# EAGLE design phono (EAGLE 5.11)
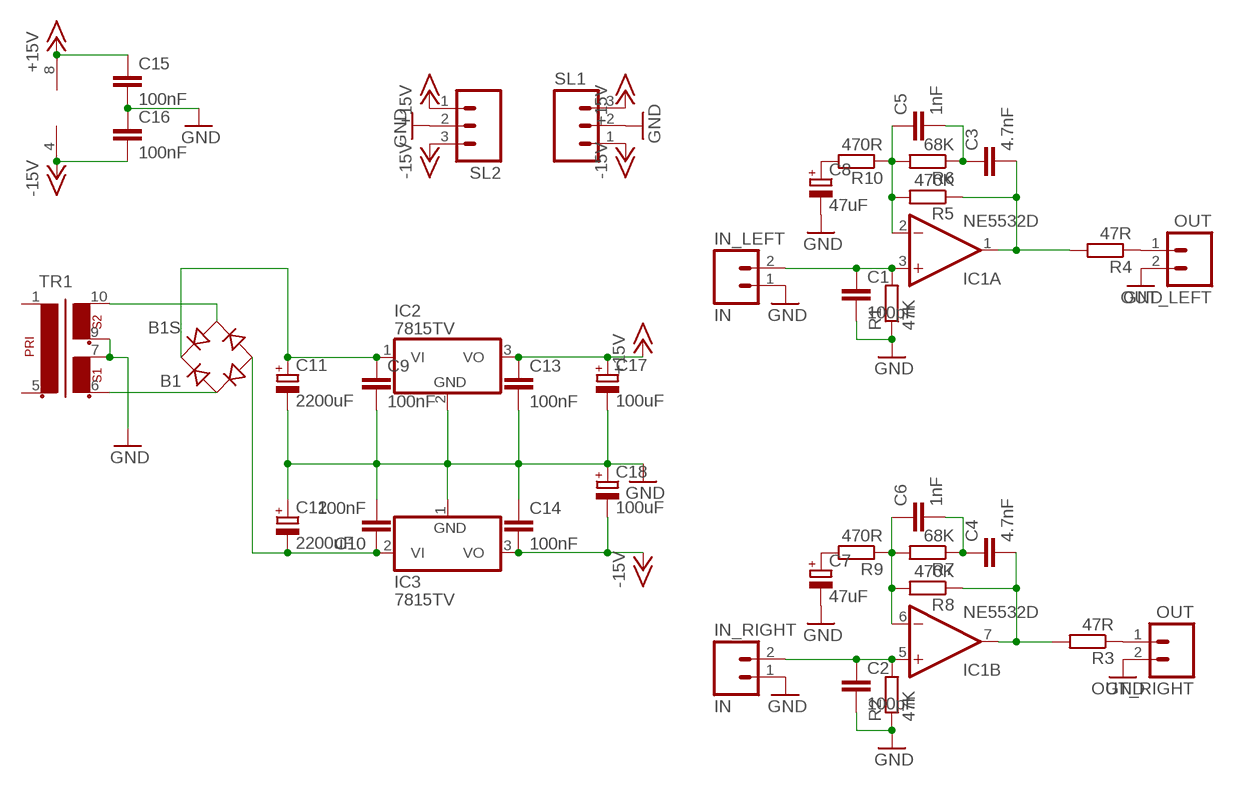
[diagram p0: schematic, sheet 1]

## Parts
B1  B1S  [MBS]
C1  100pF  C-EUC0805K  [C0805K]
C2  100pF  C-EUC0805K  [C0805K]
C3  4.7nF  C-EUC0805K  [C0805K]
C4  4.7nF  C-EUC0805K  [C0805K]
C5  1nF  C-EUC0805K  [C0805K]
C6  1nF  C-EUC0805K  [C0805K]
C7  47uF  CPOL-EUE5-5  [E5-5]
C8  47uF  CPOL-EUE5-5  [E5-5]
C9  100nF  C-EUC0805K  [C0805K]
C10  100nF  C-EUC0805K  [C0805K]
C11  2200uF  CPOL-EUE5-13  [E5-13]
C12  2200uF  CPOL-EUE5-13  [E5-13]
C13  100nF  C-EUC0805K  [C0805K]
C14  100nF  C-EUC0805K  [C0805K]
C15  100nF  C-EUC0805K  [C0805K]
C16  100nF  C-EUC0805K  [C0805K]
C17  100uF  CPOL-EUE5-13  [E5-13]
C18  100uF  CPOL-EUE5-13  [E5-13]
IC1  NE5532D  [SO08]
IC2  7815TV  [TO220V]
IC3  7815TV  7915V  [TO220V]
IN_LEFT  IN  M02  [02P]
IN_RIGHT  IN  M02  [02P]
OUT_LEFT  OUT  M02  [02P]
OUT_RIGHT  OUT  M02  [02P]
R1  47K  R-EU_R0805W  [R0805W]
R2  47K  R-EU_R0805W  [R0805W]
R3  47R  R-EU_R0805W  [R0805W]
R4  47R  R-EU_R0805W  [R0805W]
R5  470K  R-EU_R0805W  [R0805W]
R6  68K  R-EU_R0805W  [R0805W]
R7  68K  R-EU_R0805W  [R0805W]
R8  470K  R-EU_R0805W  [R0805W]
R9  470R  R-EU_R0805W  [R0805W]
R10  470R  R-EU_R0805W  [R0805W]
SL1  M03  [03P]
SL2  M03  [03P]
TR1  EI30-2  [EI30-2]

## Nets
+15V: C13.1 C15.1 C17.+ IC1.8(P:V+) IC2.3(VO) SL1.3 SL2.1
-15V: C14.2 C16.2 C18.- IC1.4(P:V-) IC3.3(VO) SL1.1 SL2.3
GND: C1.2 C2.2 C7.- C8.- C9.2 C10.2 C11.- C12.+ C13.2 C14.1 C15.2 C16.1 C17.- C18.+ IC2.2(GND) IC3.1(GND) IN_LEFT.1 IN_RIGHT.1 OUT_LEFT.2 OUT_RIGHT.2 R1.1 R2.1 SL1.2 SL2.2 TR1.7 TR1.9
N$1: B1.AC2 TR1.10
N$2: C3.2 IC1.1(A:OUT) R4.2 R5.1
N$3: C3.1 C5.2 R6.1
N$4: C4.1 C6.2 R7.1
N$5: C1.1 IC1.3(A:+IN) IN_LEFT.2 R1.2
N$6: C5.1 IC1.2(A:-IN) R5.2 R6.2 R10.1
N$7: B1.AC1 TR1.6
N$9: C2.1 IC1.5(B:+IN) IN_RIGHT.2 R2.2
N$10: C6.1 IC1.6(B:-IN) R7.2 R8.2 R9.1
N$11: C4.2 IC1.7(B:OUT) R3.2 R8.1
N$12: B1.+ C9.1 C11.+ IC2.1(VI)
N$13: C7.+ R9.2
N$14: C8.+ R10.2
N$15: B1.- C10.1 C12.- IC3.2(VI)
N$18: OUT_LEFT.1 R4.1
N$19: OUT_RIGHT.1 R3.1
Unconnected: TR1.1 TR1.5

## Library data of the parts
B1 = rectifier:B*S: Surface Mount Glass Passivated Bridge Rectifiers Source: Comchip Bridge Rectifiers B05S-G_B10S-G.pdf
C1-C6 C9 C10 C13-C16 = resistor:C-EU: CAPACITOR, European symbol
C7 C8 C11 C12 C17 C18 = resistor:CPOL-EU: POLARIZED CAPACITOR, European symbol
IC1 = linear:NE5532: AUDIO AMPLIFIER
IC2 = linear:78*: Positive VOLTAGE REGULATOR Source: http://cache.national.com/ds/LM/LM78L05.pdf http://www.fairchildsemi.com/ds/LM/LM7805.pdf
IC3 = linear:79*: Negative VOLTAGE REGULATOR
IN_LEFT IN_RIGHT OUT_LEFT OUT_RIGHT = con-amp-quick:M02: AMP QUICK CONNECTOR; OC_FARNELL: unknown; OC_NEWARK: unknown
R1-R10 = resistor:R-EU_: RESISTOR, European symbol
SL1 SL2 = con-amp-quick:M03: AMP QUICK CONNECTOR; OC_FARNELL: unknown; OC_NEWARK: unknown
TR1 = trafo:EI30-2: TRANSFORMER 1 primary winding, 2 secondary windings ERA

## Board
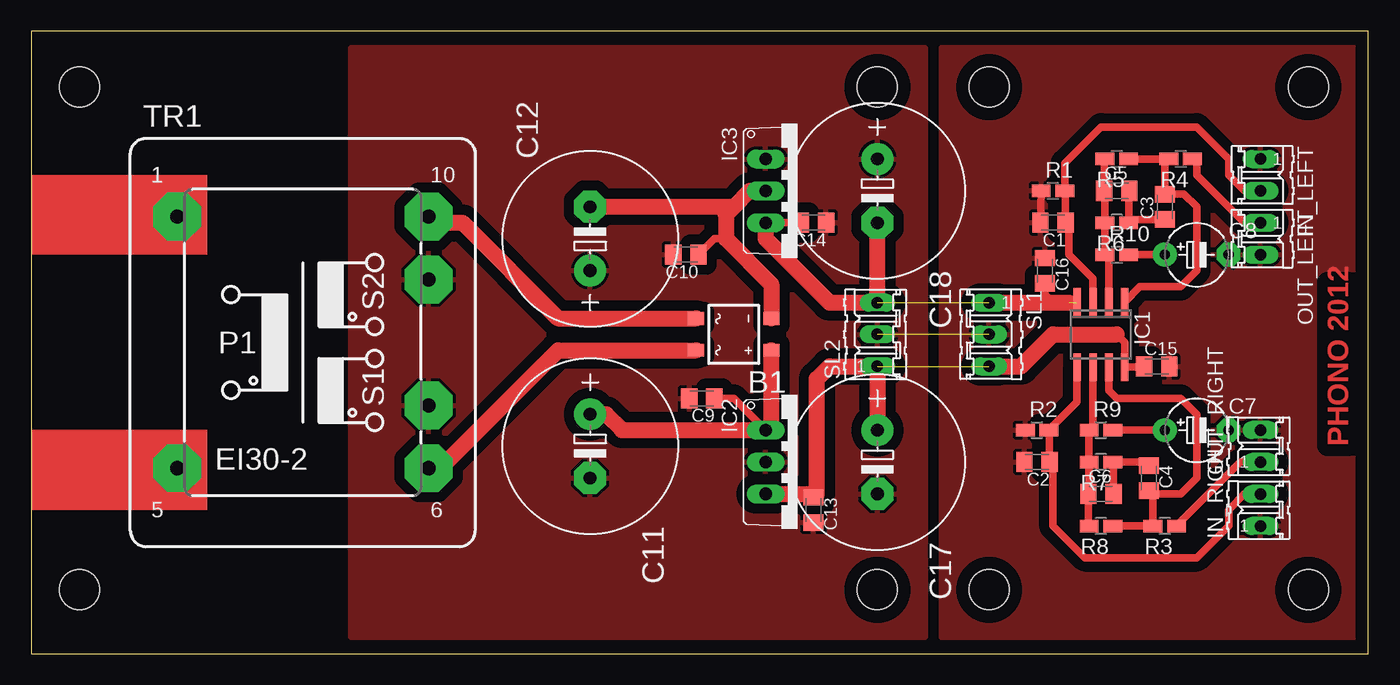
[diagram p1: board, top side]

Size 106.35 x 49.52 mm. Coordinates in mm from the lower left corner, seen from the top.
Outline: 0,0 106.35,0 106.35,49.52 0,49.52 0,0
Copper layers (1*16): Top 0.035mm / dielectric 1.5mm / Bottom 0.035mm
Design rules "default": minimum track width 10mil, minimum drill 24mil, track to track 8mil, track to pad 8mil, pad to pad 8mil, via to via 8mil, smd to smd 8mil, copper to edge 40mil, drill to drill 8mil, minimum pad ring 10mil, minimum via ring 8mil, stop-mask expansion 4mil, vias tented up to drill 0mil, thermal gap 10mil
Holes 3.2 mm at 3.81,45.09 101.6,45.09 101.6,5.08 3.81,5.08 76.2,45.09 76.2,5.08 67.31,5.08 67.31,45.09

### Footprints (pad centres in the part's own frame; a part is rotated, then mirrored left to right if it is on the bottom)
MBS = smd 1 x 1.3: + -1.27,-3; - 1.27,-3; AC1 -1.27,3; AC2 1.27,3
C0805K = smd 1.3 x 1.6: 1 -1,0; 2 1,0
E5-5 = drill 0.813 pad 1.905 round: + -2.54,0 | drill 0.813 pad 1.905 octagon: - 2.54,0
E5-13 = drill 1.016 pad 2.54 round: + -2.54,0 | drill 1.016 pad 2.54 octagon: - 2.54,0
SO08 = smd 0.6 x 2.2: 1 -1.905,-2.6; 2 -0.635,-2.6; 3 0.635,-2.6; 4 1.905,-2.6; 5 1.905,2.6; 6 0.635,2.6; 7 -0.635,2.6; 8 -1.905,2.6
TO220V = drill 1.016 long: 1 -2.54,-2.54; 2 0,-2.54; 3 2.54,-2.54
02P = drill 0.914 long: 1 -1.27,0; 2 1.27,0
R0805W = smd 1.5 x 1: 1 -0.94,0; 2 0.94,0
03P = drill 0.914 long: 1 -2.54,0; 2 0,0; 3 2.54,0
EI30-2 = drill 1.118 pad 3.81 octagon: 1 -10.008,10.008; 5 -10.008,-10.008; 6 10.008,-10.008; 7 10.008,-5.004; 9 10.008,5.004; 10 10.008,10.008

### Placement (x,y rotation side)
B1  55.88,25.4 90 top
C1  81.28,34.29 180 top
C2  80.01,15.24 180 top
C3  90.17,35.56 90 top
C4  88.9,13.97 270 top
C5  86.36,36.83 0 top
C6  85.09,12.7 0 top
C7  92.71,17.78 0 top
C8  92.71,31.75 0 top
C9  53.34,20.32 180 top
C10  52.07,31.75 180 top
C11  44.45,16.51 270 top
C12  44.45,33.02 90 top
C13  62.23,11.43 270 top
C14  62.23,34.29 180 top
C15  89.53,22.86 0 top
C16  80.64,30.48 270 top
C17  67.31,15.24 270 top
C18  67.31,36.83 270 top
IC1  85.09,25.4 180 top
IC2  60.96,15.24 270 top
IC3  60.96,36.83 270 top
IN_LEFT  97.79,38.1 270 top
IN_RIGHT  97.79,11.43 90 top
OUT_LEFT  97.79,33.02 270 top
OUT_RIGHT  97.79,16.51 90 top
R1  81.28,36.83 0 top
R2  80.01,17.78 0 top
R3  90.17,10.16 180 top
R4  91.44,39.37 180 top
R5  86.36,39.37 180 top
R6  86.36,34.29 180 top
R7  85.09,15.24 180 top
R8  85.09,10.16 180 top
R9  85.09,17.78 0 top
R10  86.36,31.75 0 top
SL1  76.2,25.4 270 top
SL2  67.31,25.4 90 top
TR1  21.59,24.77 0 top

### Tracks (layer width: path | path; a pad name or v marks a point on that pad's centre or on a via)
+15V  (1 unrouted)
  Top 0.61: 86.36,25.4 87,24.77 IC1.8 88.47,22.8 C15.1
  Top 1.27: IC2.3 61.96,12.7 C13.1 62.5,12.7 62.5,21.86 63.5,22.86 SL2.1 C17.+ | SL1.3 78.74,22.86 81.28,25.4 86.36,25.4
-15V  (2 unrouted)
  Top 0.61: IC1.4 83.12,27.94 | C16.2 80.64,28.57 81.28,27.94 | IC3.3 C14.2
  Top 1.27: 82.55,27.94 81.28,27.94 SL1.1 | C18.- SL2.3 63.5,27.94 58.42,33.02 IC3.3
GND  (1 unrouted)
  Top 0.61: C1.2 80.28,34.23 R1.1
  pour Top (isolate 0.813): 72.39,48.26 105.41,48.26 105.41,1.27 72.39,1.27
  pour Top (isolate 0.813): 25.4,48.26 71.12,48.26 71.12,1.27 25.4,1.27
N$1
  Top 1.27: B1.AC2 41.91,26.67 34.29,34.29 32.08,34.29 TR1.10
N$2
  Top 0.61: IC1.1 88.2,29.21 91.44,29.21 92.71,30.48 92.71,35.56 91.71,36.56 C3.2 90.17,39.04 R4.2 R5.1
N$3
  Top 0.61: C5.2 87.3,36.77 R6.1 87.57,34.56 C3.1
N$4
  Top 0.61: C6.2 86.09,15.18 R7.1 88.63,15.24 C4.1
N$5
  Top 0.61: IC1.3 84.45,29.84 82.55,31.75 82.55,34.02 C1.1 82.28,36.77 R1.2 82.22,39.04 85.09,41.91 92.71,41.91 95.25,39.37 95.25,38.1 96.52,36.83 IN_LEFT.2
N$6
  Top 0.61: IC1.2 85.72,31.45 R10.1 R6.2 85.42,36.77 C5.1 85.36,39.31 R5.2
N$7
  Top 1.27: B1.AC1 41.91,24.13 33.02,15.24 32.08,15.24 TR1.6
N$9
  Top 0.61: IC1.5 83.19,20.02 R2.2 81.01,17.72 C2.1 81.28,14.97 81.28,10.16 83.82,7.62 92.71,7.62 95.25,10.16 95.25,11.43 96.52,12.7 IN_RIGHT.2
N$10
  Top 0.61: IC1.6 84.45,18.09 R9.1 R7.2 84.15,12.76 C6.1 84.09,10.22 R8.2
N$11
  Top 0.61: IC1.7 85.72,20.95 86.36,20.32 91.44,20.32 92.71,19.05 92.71,13.97 91.44,12.7 89.17,12.7 | 89.17,12.7 C4.2 | 89.17,12.7 89.23,12.64 R3.2 R8.1
N$12
  Top 0.61: C9.1 55.88,20.32 IC2.1
  Top 1.27: C11.+ 45.72,19.05 46.99,17.78 IC2.1 58.88,18.24 B1.+
N$13
  Top 0.61: R9.2 C7.+
N$14
  Top 0.61: R10.2 C8.+
N$15
  Top 0.61: C10.1 54.34,33.02 55.24,33.02
  Top 1.27: B1.- 58.88,29.38 55.24,33.02 55.24,34.92 55.88,35.56 | 55.88,35.56 57.15,36.83 IC3.2 | C12.- 55.88,35.56
N$18
  Top 0.61: OUT_LEFT.1 96.52,34.29 92.71,38.1 92.71,39.04 R4.1
N$19
  Top 0.61: OUT_RIGHT.1 96.19,15.24 R3.1
(copper drawn outside any net)
  shapes: Top area x2

### Text on the board
Top: PHONO 2012